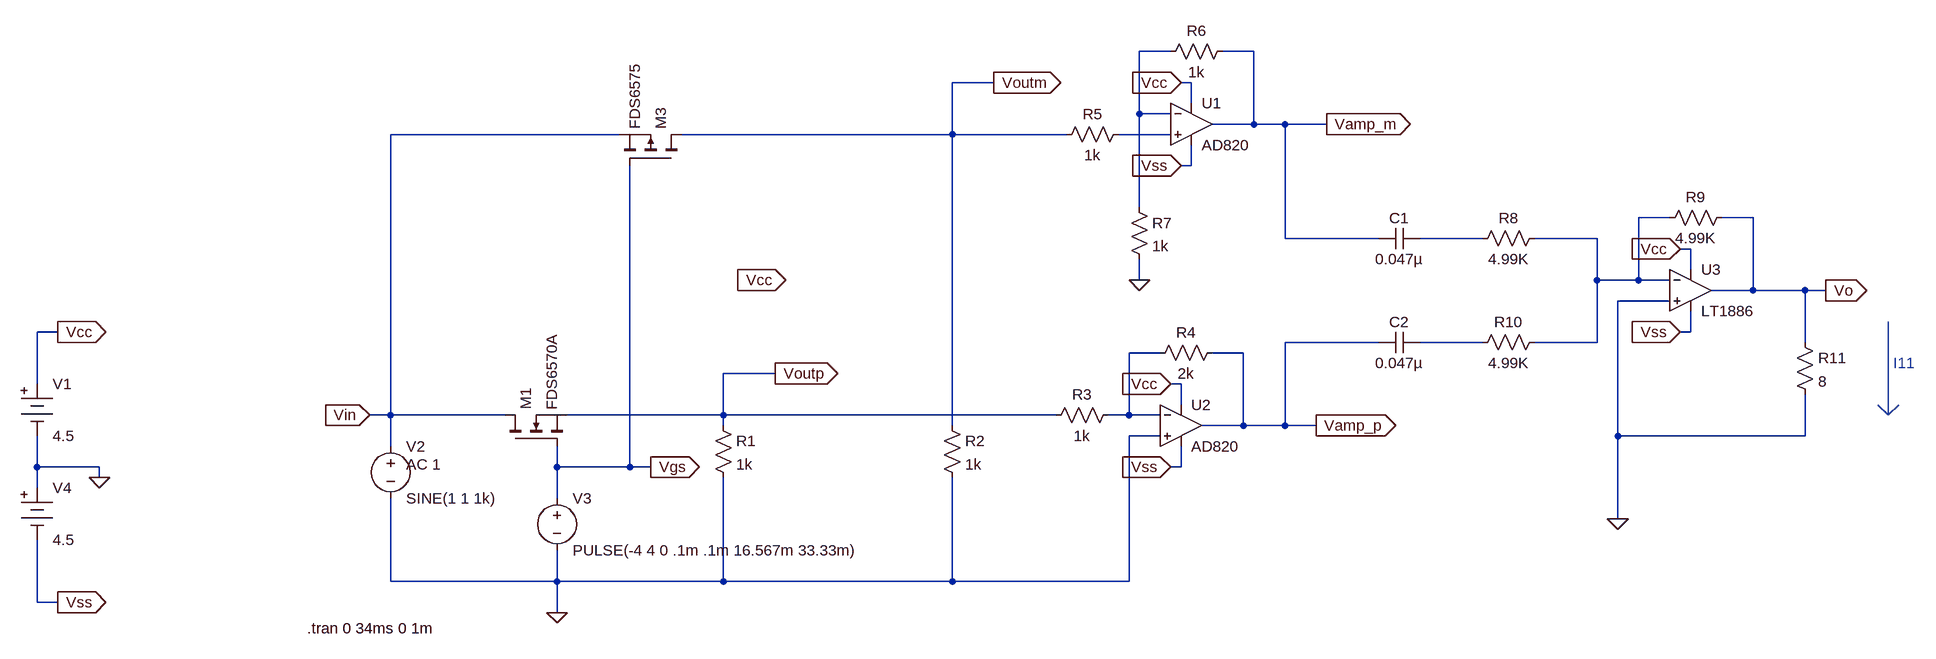
[diagram p0: schematic My Voice Changer.asc]
My Voice Changer.asc, the LTspice schematic file:
Version 4
SHEET 1 2104 680
WIRE 800 -848 752 -848
WIRE 928 -848 880 -848
WIRE 528 -800 464 -800
WIRE 832 -800 816 -800
WIRE 832 -768 832 -800
WIRE 752 -752 752 -848
WIRE 800 -752 752 -752
WIRE 928 -736 928 -848
WIRE 928 -736 864 -736
WIRE 976 -736 928 -736
WIRE 1040 -736 976 -736
WIRE -48 -720 -400 -720
WIRE 464 -720 464 -800
WIRE 464 -720 48 -720
WIRE 640 -720 464 -720
WIRE 800 -720 720 -720
WIRE 832 -672 832 -704
WIRE 832 -672 816 -672
WIRE 752 -608 752 -752
WIRE 1568 -592 1520 -592
WIRE 1696 -592 1648 -592
WIRE 976 -560 976 -736
WIRE 1120 -560 976 -560
WIRE 1280 -560 1184 -560
WIRE 1456 -560 1360 -560
WIRE 1600 -544 1584 -544
WIRE 1600 -512 1600 -544
WIRE 752 -496 752 -528
WIRE 1456 -496 1456 -560
WIRE 1520 -496 1520 -592
WIRE 1520 -496 1456 -496
WIRE 1568 -496 1520 -496
WIRE 1696 -480 1696 -592
WIRE 1696 -480 1632 -480
WIRE 1776 -480 1696 -480
WIRE 1808 -480 1776 -480
WIRE 1568 -464 1488 -464
WIRE -912 -416 -944 -416
WIRE 1600 -416 1600 -448
WIRE 1600 -416 1584 -416
WIRE 1120 -400 976 -400
WIRE 1280 -400 1184 -400
WIRE 1456 -400 1456 -496
WIRE 1456 -400 1360 -400
WIRE 1776 -400 1776 -480
WIRE 784 -384 736 -384
WIRE 912 -384 864 -384
WIRE 192 -352 112 -352
WIRE -944 -336 -944 -416
WIRE 816 -336 800 -336
WIRE 816 -304 816 -336
WIRE -400 -288 -400 -720
WIRE -400 -288 -432 -288
WIRE -224 -288 -400 -288
WIRE 112 -288 112 -352
WIRE 112 -288 -128 -288
WIRE 624 -288 112 -288
WIRE 736 -288 736 -384
WIRE 736 -288 704 -288
WIRE 784 -288 736 -288
WIRE 112 -272 112 -288
WIRE 464 -272 464 -720
WIRE 912 -272 912 -384
WIRE 912 -272 848 -272
WIRE 976 -272 976 -400
WIRE 976 -272 912 -272
WIRE 1024 -272 976 -272
WIRE 784 -256 736 -256
WIRE 1488 -256 1488 -464
WIRE 1776 -256 1776 -320
WIRE 1776 -256 1488 -256
WIRE -400 -240 -400 -288
WIRE -944 -208 -944 -256
WIRE -848 -208 -944 -208
WIRE -144 -208 -144 -240
WIRE -32 -208 -32 -672
WIRE -32 -208 -144 -208
WIRE 0 -208 -32 -208
WIRE 816 -208 816 -240
WIRE 816 -208 800 -208
WIRE -848 -192 -848 -208
WIRE -944 -176 -944 -208
WIRE -144 -160 -144 -208
WIRE 1488 -128 1488 -256
WIRE -400 -32 -400 -160
WIRE -144 -32 -144 -80
WIRE -144 -32 -400 -32
WIRE 112 -32 112 -192
WIRE 112 -32 -144 -32
WIRE 464 -32 464 -192
WIRE 464 -32 112 -32
WIRE 736 -32 736 -256
WIRE 736 -32 464 -32
WIRE -944 0 -944 -96
WIRE -912 0 -944 0
WIRE -144 16 -144 -32
FLAG -144 16 0
FLAG -432 -288 Vin
IOPIN -432 -288 In
FLAG 192 -352 Voutp
IOPIN 192 -352 Out
FLAG 528 -800 Voutm
IOPIN 528 -800 Out
FLAG 752 -496 0
FLAG -848 -192 0
FLAG -912 -416 Vcc
IOPIN -912 -416 Out
FLAG 816 -800 Vcc
IOPIN 816 -800 In
FLAG 1040 -736 Vamp_m
IOPIN 1040 -736 Out
FLAG 1024 -272 Vamp_p
IOPIN 1024 -272 Out
FLAG 0 -208 Vgs
IOPIN 0 -208 Out
FLAG 800 -336 Vcc
IOPIN 800 -336 In
FLAG 208 -496 Vcc
IOPIN 208 -496 In
FLAG -912 0 Vss
IOPIN -912 0 Out
FLAG 816 -672 Vss
IOPIN 816 -672 In
FLAG 800 -208 Vss
IOPIN 800 -208 In
FLAG 1808 -480 Vo
IOPIN 1808 -480 Out
FLAG 1584 -544 Vcc
IOPIN 1584 -544 In
FLAG 1584 -416 Vss
IOPIN 1584 -416 In
FLAG 1488 -128 0
SYMBOL nmos -224 -240 R270
SYMATTR InstName M1
SYMATTR Value FDS6570A
SYMBOL voltage -400 -256 R0
WINDOW 123 24 44 Left 2
WINDOW 39 0 0 Left 0
SYMATTR Value2 AC 1
SYMATTR InstName V2
SYMATTR Value SINE(1 1 1k)
SYMBOL voltage -144 -176 R0
WINDOW 123 24 44 Left 2
WINDOW 39 0 0 Left 0
SYMATTR InstName V3
SYMATTR Value PULSE(-4 4 0 .1m .1m 16.567m 33.33m)
SYMBOL res 96 -288 R0
SYMATTR InstName R1
SYMATTR Value 1k
SYMBOL res 448 -288 R0
SYMATTR InstName R2
SYMATTR Value 1k
SYMBOL pmos 48 -672 M270
SYMATTR InstName M3
SYMATTR Value FDS6575
SYMBOL res 736 -736 R90
WINDOW 0 0 56 VBottom 2
WINDOW 3 32 56 VTop 2
SYMATTR InstName R5
SYMATTR Value 1k
SYMBOL res 896 -864 R90
WINDOW 0 0 56 VBottom 2
WINDOW 3 32 56 VTop 2
SYMATTR InstName R6
SYMATTR Value 1k
SYMBOL res 736 -624 R0
SYMATTR InstName R7
SYMATTR Value 1k
SYMBOL Misc\\battery -944 -352 R0
WINDOW 123 0 0 Left 0
WINDOW 39 0 0 Left 0
SYMATTR InstName V1
SYMATTR Value 4.5
SYMBOL Opamps\\AD820 832 -800 R0
SYMATTR InstName U1
SYMBOL res 720 -304 R90
WINDOW 0 0 56 VBottom 2
WINDOW 3 32 56 VTop 2
SYMATTR InstName R3
SYMATTR Value 1k
SYMBOL res 880 -400 R90
WINDOW 0 0 56 VBottom 2
WINDOW 3 32 56 VTop 2
SYMATTR InstName R4
SYMATTR Value 2k
SYMBOL Opamps\\AD820 816 -336 R0
SYMATTR InstName U2
SYMBOL Misc\\battery -944 -192 R0
WINDOW 123 0 0 Left 0
WINDOW 39 0 0 Left 0
SYMATTR InstName V4
SYMATTR Value 4.5
SYMBOL res 1376 -576 R90
WINDOW 0 0 56 VBottom 2
WINDOW 3 32 56 VTop 2
SYMATTR InstName R8
SYMATTR Value 4.99K
SYMATTR SpiceLine tol=1 pwr=0.1
SYMBOL res 1664 -608 R90
WINDOW 0 0 56 VBottom 2
WINDOW 3 32 56 VTop 2
SYMATTR InstName R9
SYMATTR Value 4.99K
SYMATTR SpiceLine tol=1 pwr=0.1
SYMBOL res 1376 -416 R90
WINDOW 0 0 56 VBottom 2
WINDOW 3 32 56 VTop 2
SYMATTR InstName R10
SYMATTR Value 4.99K
SYMATTR SpiceLine tol=1 pwr=0.1
SYMBOL cap 1184 -576 R90
WINDOW 0 0 32 VBottom 2
WINDOW 3 32 32 VTop 2
SYMATTR InstName C1
SYMATTR Value 0.047µ
SYMATTR SpiceLine V=4 Irms=760m Rser=0.0732706 Lser=0 mfg="KEMET" pn="C0402C473K7PAC" type="X5R"
SYMBOL cap 1184 -416 R90
WINDOW 0 0 32 VBottom 2
WINDOW 3 32 32 VTop 2
SYMATTR InstName C2
SYMATTR Value 0.047µ
SYMATTR SpiceLine V=4 Irms=760m Rser=0.0732706 Lser=0 mfg="KEMET" pn="C0402C473K7PAC" type="X5R"
SYMBOL res 1760 -416 R0
SYMATTR InstName R11
SYMATTR Value 8
SYMBOL Opamps\\LT1886 1600 -544 R0
SYMATTR InstName U3
TEXT -528 40 Left 2 !.tran 0 34ms 0 1m
TEXT 1912 -368 Left 2 ;I11
LINE Normal 1904 -288 1904 -432
LINE Normal 1920 -304 1904 -288
LINE Normal 1888 -304 1904 -288

The netlist it stands for:
* My Voice Changer.asc
M1 Vin Vgs Voutp Voutp FDS6570A
V2 Vin 0 SINE(1 1 1k) AC 1
V3 Vgs 0 PULSE(-4 4 0 .1m .1m 16.567m 33.33m)
R1 Voutp 0 1k
R2 Voutm 0 1k
M3 Voutm Vgs Vin Vin FDS6575
R5 N002 Voutm 1k
R6 Vamp_m N001 1k
R7 N001 0 1k
V1 Vcc 0 4.5
XU1 N002 N001 Vcc Vss Vamp_m AD820  ; pins In+ In- V+ V- OUT
R3 N006 Voutp 1k
R4 Vamp_p N006 2k
XU2 0 N006 Vcc Vss Vamp_p AD820  ; pins In+ In- V+ V- OUT
V4 0 Vss 4.5
R8 N003 N004 4.99K tol=1 pwr=0.1
R9 Vo N003 4.99K tol=1 pwr=0.1
R10 N003 N005 4.99K tol=1 pwr=0.1
C1 N004 Vamp_m 0.047µ V=4 Irms=760m Rser=0.0732706 Lser=0 mfg="KEMET" pn="C0402C473K7PAC" type="X5R"
C2 N005 Vamp_p 0.047µ V=4 Irms=760m Rser=0.0732706 Lser=0 mfg="KEMET" pn="C0402C473K7PAC" type="X5R"
R11 Vo 0 8
XU3 0 N003 Vcc Vss Vo LT1886  ; pins In+ In- V+ V- OUT
.model NMOS NMOS
.model PMOS PMOS
.lib standard.mos
.tran 0 34ms 0 1m
* I11
.backanno
.end